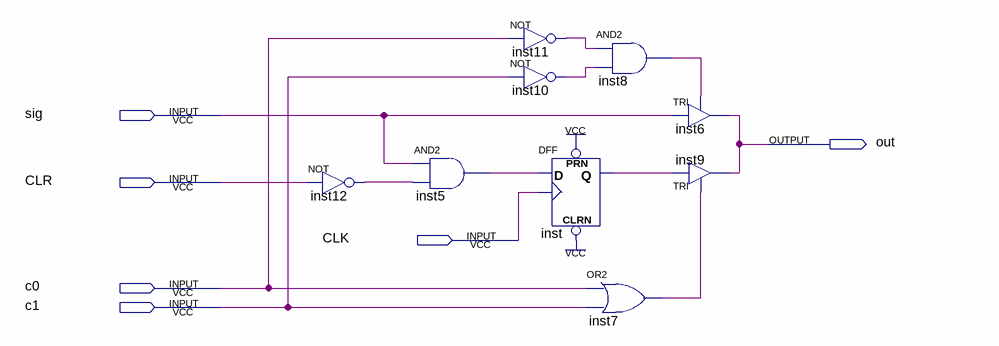
[diagram p0: schematic sheet]
// Quartus schematic decod_inst_signal_register.bdf as structural Verilog: 9 symbols, 6 pins
module decod_inst_signal_register (
  input  sig,
  input  CLR,
  input  CLK,
  input  c0,
  input  c1,
  output out
);

  wire inst5_out, inst7_out, inst8_out, inst10_out, inst11_out, inst12_out, inst_q;

  not inst12 (inst12_out, CLR);
  and inst5 (inst5_out, sig, inst12_out);
  not inst11 (inst11_out, c0);
  not inst10 (inst10_out, c1);
  and inst8 (inst8_out, inst11_out, inst10_out);
  DFF inst (.CLRN(1'b1), .CLK(CLK), .D(inst5_out), .PRN(1'b1), .Q(inst_q));
  or inst7 (inst7_out, c0, c1);
  TRI inst6 (.IN(sig), .OE(inst8_out), .OUT(out));
  TRI inst9 (.IN(inst_q), .OE(inst7_out), .OUT(out));
endmodule
